# Altium schematic sheet Power.SchDoc
size A; SheetNumber: 3; SheetTotal: 4
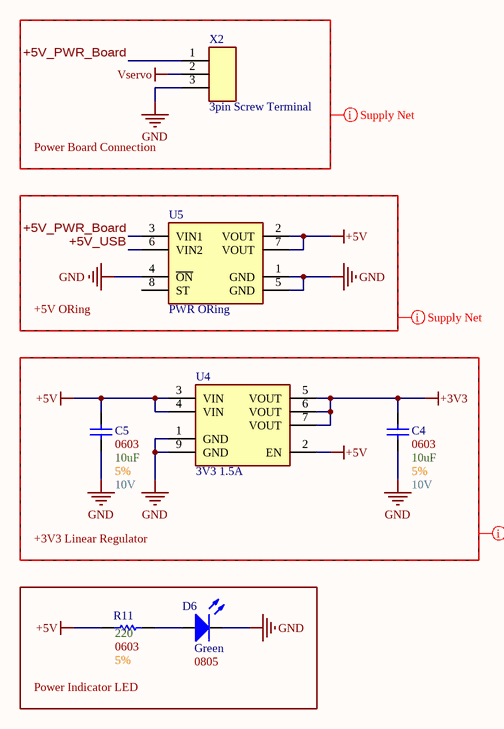
[diagram p0: Power.SchDoc]

## Parts
C4  Size Package: 0603  Capacitance: 10uF  Voltage: 10V  Tolerance: 5%  [[Cap] SMD 0603]  (hidden comment: [Cap] SMD Nonpolarized)
C5  Size Package: 0603  Capacitance: 10uF  Voltage: 10V  Tolerance: 5%  [[Cap] SMD 0603]  (hidden comment: [Cap] SMD Nonpolarized)
D6  Color: Green  Size Package: 0805  [[LED] SMD 0805]  (hidden comment: SMD LED)
R11  Resistance: 220  Size Package: 0603  Tolerance: 5%  [[Res] SMD 0603]  (hidden comment: [Res] SMD Resistor)
U4  3V3 1.5A  [[Reg Lin] 3V3 Regulator 1.5A]
U5  PWR ORing  [[IC] Power ORing Controller]
X2  3pin Screw Terminal  [[Screw Terminal] 3pin 5mm]

## Blocks framed on the sheet
Power Board Connection: X2
+5V ORing: U5
+3V3 Linear Regulator: C4 C5 U4
Power Indicator LED: D6 R11

## Nets
+3V3: C4.2 U4.5(VOUT) U4.6(VOUT) U4.7(VOUT)
+5V: C5.2 R11.2 U4.2(EN) U4.3(VIN) U4.4(VIN) U5.2(VOUT) U5.7(VOUT)
GND: C4.1 C5.1 D6.2(Cathode) U4.1(GND) U4.9(GND) U5.1(GND) U5.4(~{ON}) U5.5(GND) X2.3
Vservo: X2.2
+5V_PWR_Board: U5.3(VIN1) X2.1
+5V_USB: U5.6(VIN2)
NetD6_1: D6.1(Anode) R11.1

Not connected (* = marked no-connect by the designer): U5 8(ST)

## Layout directives
net class Supply_Nets: +3V3, +5V, +5V_PWR_Board, +5V_USB, GND, Vservo

## Library data of the parts
D6 = [LED] SMD: Generic; Part #: *; Supplier 1: DigiKey; Supplier Part Number 1: 475-LGR971-KN-1DKR-ND
R11 = [Res] SMD Resistor: Generic; Supplier 1: DigiKey; Supplier Part Number 1: A129741CT-ND
U4 = [Reg Lin] 3V3 Regulator 1.5A: AP7362A-33SP-13; Supplier 1: DigiKey; Supplier Part Number 1: AP7362A-33SP-13DICT-ND
U5 = [IC] Power ORing Controller: Supplier 1: DigiKey; Supplier Part Number 1: 296-LM66200DRLRCT-ND
X2 = [Screw Terminal] 3pin: Supplier 1: DigiKey; Supplier Part Number 1: 102-6162-ND
C4 C5 = [Cap] SMD Nonpolarized: Supplier 1: DigiKey; Supplier Part Number 1: 1276-1192-1-ND